# EAGLE schematic dlp.vco.v1.0 (EAGLE 7.2.0)
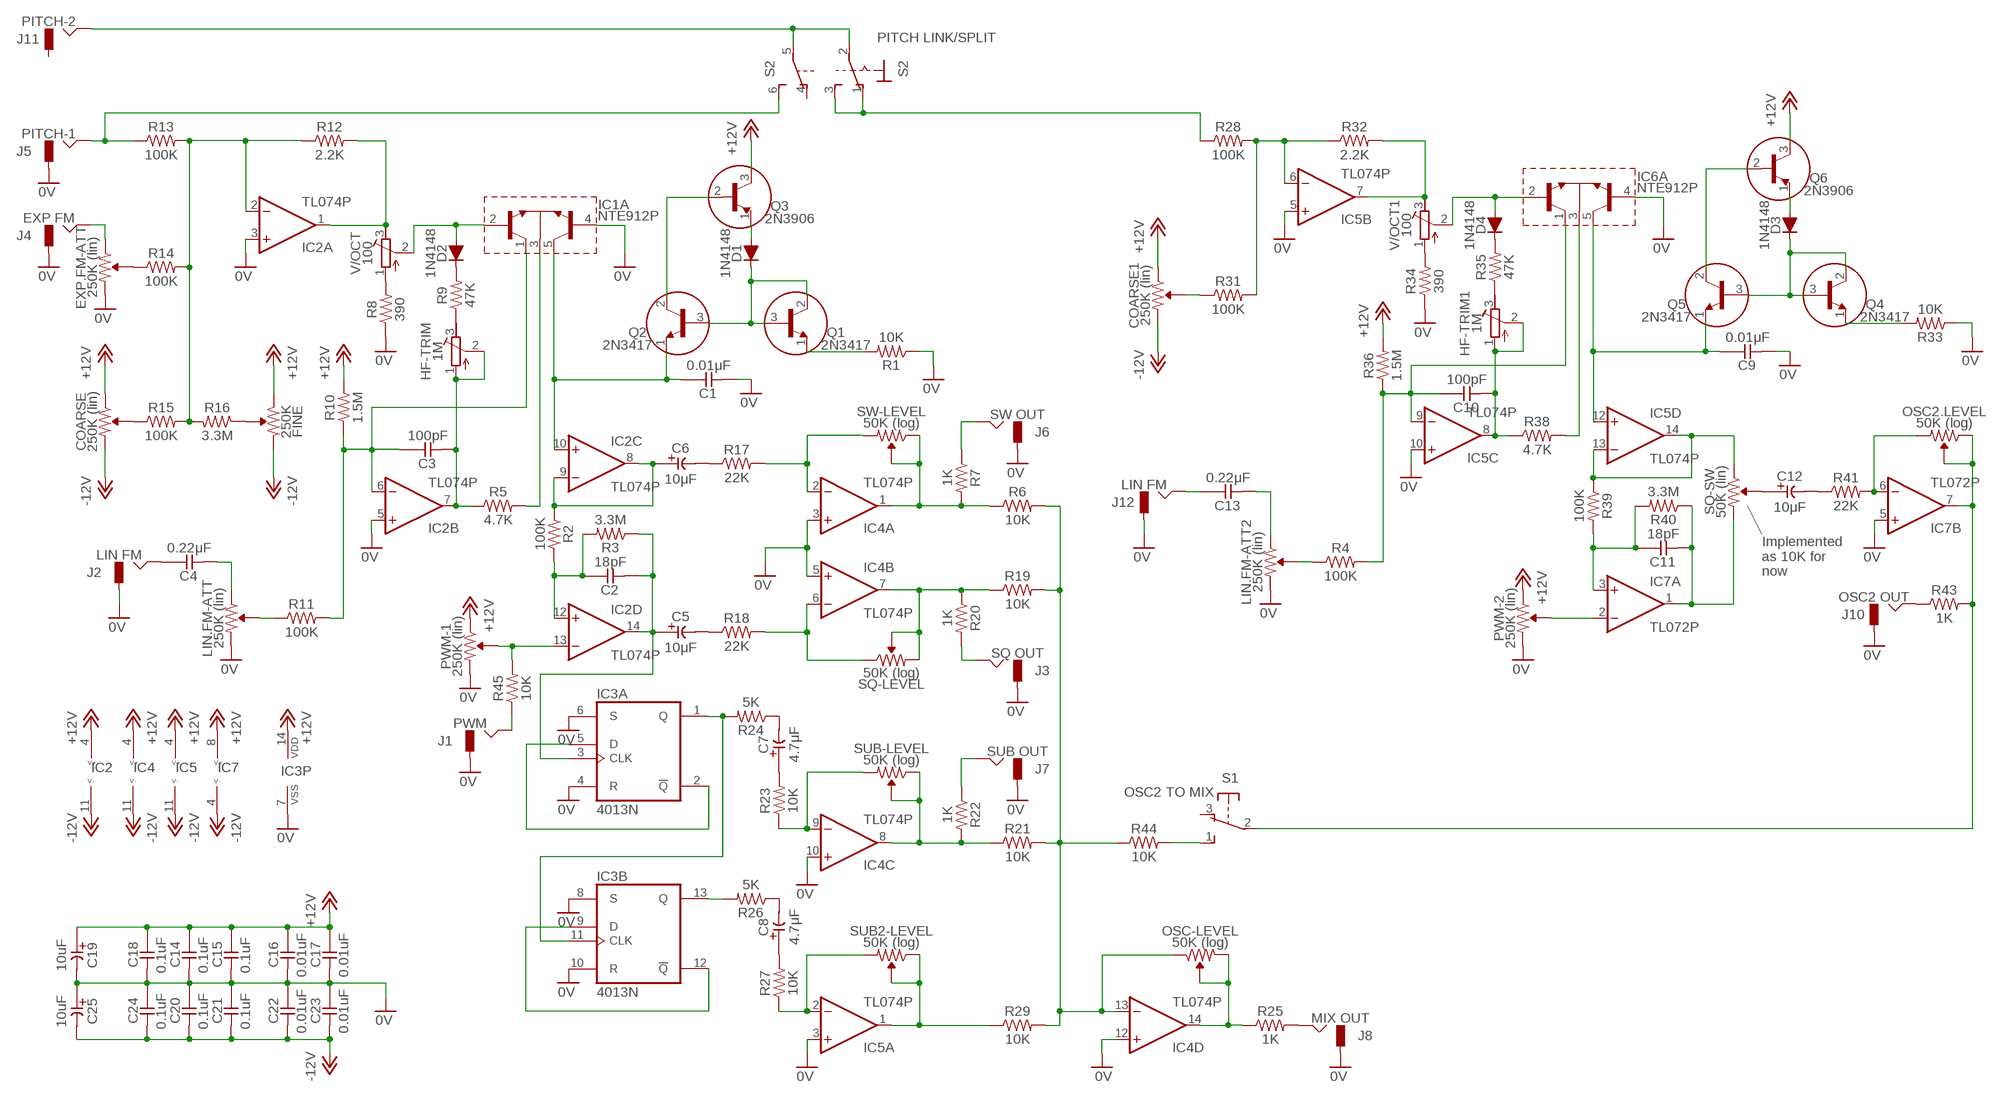
[diagram p0: schematic, sheet 1]

## Parts
C1  0.01μF  CC-US025-024X044  [C025-024X044]
C2  18pF  CC-US025-024X044  [C025-024X044]
C3  100pF  CC-US025-024X044  [C025-024X044]
C4  0.22μF  CC-US025-024X044  [C025-024X044]
C5  10μF  CE-USE2-5  [E2-5]
C6  10μF  CE-USE2-5  [E2-5]
C7  4.7μF  CE-USE2-5  [E2-5]
C8  4.7μF  CE-USE2-5  [E2-5]
C9  0.01μF  CC-US025-024X044  [C025-024X044]
C10  100pF  CC-US025-024X044  [C025-024X044]
C11  18pF  CC-US025-024X044  [C025-024X044]
C12  10μF  CE-USE2-5  [E2-5]
C13  0.22μF  CC-US025-024X044  [C025-024X044]
C14  0.1uF  CC-US025-024X044  [C025-024X044]
C15  0.1uF  CC-US025-024X044  [C025-024X044]
C16  0.01uF  CC-US025-024X044  [C025-024X044]
C17  0.01uF  CC-US025-024X044  [C025-024X044]
C18  0.1uF  CC-US025-024X044  [C025-024X044]
C19  10uF  CE-USE2-5  [E2-5]
C20  0.1uF  CC-US025-024X044  [C025-024X044]
C21  0.1uF  CC-US025-024X044  [C025-024X044]
C22  0.01uF  CC-US025-024X044  [C025-024X044]
C23  0.01uF  CC-US025-024X044  [C025-024X044]
C24  0.1uF  CC-US025-024X044  [C025-024X044]
C25  10uF  CE-USE2-5  [E2-5]
COARSE  250K (lin)  R-VAR  [R-VAR]
COARSE1  250K (lin)  R-VAR  [R-VAR]
D1  1N4148  [DO35-7]
D2  1N4148  [DO35-7]
D3  1N4148  [DO35-7]
D4  1N4148  [DO35-7]
EXP.FM-ATT  250K (lin)  R-VAR  [R-VAR]
FINE  250K  R-VAR  [R-VAR]
HF-TRIM  1M  R-TRIMM3304W  [RTRIM3304W]
HF-TRIM1  1M  R-TRIMM3304W  [RTRIM3304W]
IC1  NTE912P  [DIL14]
IC2  TL074P  [DIL14]
IC3  4013N  [DIL14]
IC4  TL074P  [DIL14]
IC5  TL074P  [DIL14]
IC6  NTE912P  [DIL14]
IC7  TL072P  [DIL08]
J1  PWM  JACK-M  [JACK-M]
J2  LIN FM  JACK-M  [JACK-M]
J3  SQ OUT  JACK-M  [JACK-M]
J4  EXP FM  JACK-M  [JACK-M]
J5  PITCH-1  JACK-M  [JACK-M]
J6  SW OUT  JACK-M  [JACK-M]
J7  SUB OUT  JACK-M  [JACK-M]
J8  MIX OUT  JACK-M  [JACK-M]
J10  OSC2 OUT  JACK-M  [JACK-M]
J11  PITCH-2  JACK-M  [JACK-M]
J12  LIN FM  JACK-M  [JACK-M]
LIN.FM-ATT  250K (lin)  R-VAR  [R-VAR]
LIN.FM-ATT2  250K (lin)  R-VAR  [R-VAR]
OSC2.LEVEL  50K (log)  R-VAR  [R-VAR]
OSC-LEVEL  50K (log)  R-VAR  [R-VAR]
PWM-1  250K (lin)  R-VAR  [R-VAR]
PWM-2  250K (lin)  R-VAR  [R-VAR]
Q1  2N3417  [TO92]
Q2  2N3417  [TO92]
Q3  2N3906  [TO92]
Q4  2N3417  [TO92]
Q5  2N3417  [TO92]
Q6  2N3906  [TO92]
R1  10K  R0309/10  [0309/10]
R2  100K  R0309/10  [0309/10]
R3  3.3M  R0309/10  [0309/10]
R4  100K  R0309/10  [0309/10]
R5  4.7K  R0309/10  [0309/10]
R6  10K  R0309/10  [0309/10]
R7  1K  R0309/10  [0309/10]
R8  390  R0309/10  [0309/10]
R9  47K  R0309/10  [0309/10]
R10  1.5M  R0309/10  [0309/10]
R11  100K  R0309/10  [0309/10]
R12  2.2K  R0309/10  [0309/10]
R13  100K  R0309/10  [0309/10]
R14  100K  R0309/10  [0309/10]
R15  100K  R0309/10  [0309/10]
R16  3.3M  R0309/10  [0309/10]
R17  22K  R0309/10  [0309/10]
R18  22K  R0309/10  [0309/10]
R19  10K  R0309/10  [0309/10]
R20  1K  R0309/10  [0309/10]
R21  10K  R0309/10  [0309/10]
R22  1K  R0309/10  [0309/10]
R23  10K  R0309/10  [0309/10]
R24  5K  R0309/10  [0309/10]
R25  1K  R0309/10  [0309/10]
R26  5K  R0309/10  [0309/10]
R27  10K  R0309/10  [0309/10]
R28  100K  R0309/10  [0309/10]
R29  10K  R0309/10  [0309/10]
R31  100K  R0309/10  [0309/10]
R32  2.2K  R0309/10  [0309/10]
R33  10K  R0309/10  [0309/10]
R34  390  R0309/10  [0309/10]
R35  47K  R0309/10  [0309/10]
R36  1.5M  R0309/10  [0309/10]
R38  4.7K  R0309/10  [0309/10]
R39  100K  R0309/10  [0309/10]
R40  3.3M  R0309/10  [0309/10]
R41  22K  R0309/10  [0309/10]
R43  1K  R0309/10  [0309/10]
R44  10K  R0309/10  [0309/10]
R45  10K  R0309/10  [0309/10]
S1  OSC2 TO MIX  9077-1  [9077-1]
S2  320-938  [320-938]
SQ-LEVEL  50K (log)  R-VAR  [R-VAR]
SQ-SW  50K (lin)  R-VAR  [R-VAR]
SUB2-LEVEL  50K (log)  R-VAR  [R-VAR]
SUB-LEVEL  50K (log)  R-VAR  [R-VAR]
SW-LEVEL  50K (log)  R-VAR  [R-VAR]
V/OCT  100  R-TRIMM3304W  [RTRIM3304W]
V/OCT1  100  R-TRIMM3304W  [RTRIM3304W]

## Nets
0V: C1.2 C9.2 C14.2 C15.2 C16.2 C17.2 C18.2 C19.- C20.1 C21.1 C22.1 C23.1 C24.1 C25.+ EXP.FM-ATT.R2 IC1.4(A:B3) IC2.3(A:+IN) IC2.5(B:+IN) IC3.4(A:R) IC3.6(A:S) IC3.7(P:VSS) IC3.8(B:S) IC3.10(B:R) IC4.3(A:+IN) IC4.5(B:+IN) IC4.10(C:+IN) IC4.12(D:+IN) IC5.3(A:+IN) IC5.5(B:+IN) IC5.10(C:+IN) IC6.4(A:B3) IC7.5(B:+IN) J1.GND J2.GND J3.GND J4.GND J5.GND J6.GND J7.GND J8.GND J10.GND J12.GND LIN.FM-ATT2.R2 LIN.FM-ATT.R2 PWM-1.R2 PWM-2.R2 R1.1 R8.1 R33.1 R34.1
+12V: C14.1 C15.1 C16.1 C17.1 C18.1 C19.+ COARSE1.R1 COARSE.R1 FINE.R1 IC2.4(P:V+) IC3.14(P:VDD) IC4.4(P:V+) IC5.4(P:V+) IC7.8(P:V+) PWM-1.R1 PWM-2.R1 Q3.3(C) Q6.3(C) R10.2 R36.2
-12V: C20.2 C21.2 C22.2 C23.2 C24.2 C25.- COARSE1.R2 COARSE.R2 FINE.R2 IC2.11(P:V-) IC4.11(P:V-) IC5.11(P:V-) IC7.4(P:V-)
N$1: C1.1 IC1.5(A:C3) IC2.10(C:+IN) Q2.1(E)
N$2: Q2.2(C) Q3.2(B)
N$3: D1.A Q3.1(E)
N$4: C6.+ IC2.8(C:OUT) IC2.9(C:-IN) R2.1
N$5: D1.C Q1.2(C) Q1.3(B) Q2.3(B)
N$6: Q1.1(E) R1.2
N$7: C2.1 IC2.12(D:+IN) R2.2 R3.2
N$8: J1.HOT R45.1
N$9: C2.2 C5.+ IC2.14(D:OUT) IC3.3(A:CLK) R3.1
N$10: IC2.13(D:-IN) PWM-1.VAR R45.2
N$11: C3.2 HF-TRIM.1(E) HF-TRIM.2(S) IC2.7(B:OUT) R5.1
N$12: IC1.3(A:E) R5.2
N$13: D2.C R9.2
N$14: R8.2 V/OCT.1(E)
N$15: C3.1 IC1.1(A:C1) IC2.6(B:-IN) R10.1 R11.2
N$16: IC2.1(A:OUT) R12.2 V/OCT.3(A)
N$17: HF-TRIM.3(A) R9.1
N$18: LIN.FM-ATT.VAR R11.1
N$19: C4.2 LIN.FM-ATT.R1
N$20: C4.1 J2.HOT
N$21: IC3.1(A:Q) IC3.11(B:CLK) R24.2
N$22: IC4.2(A:-IN) R17.2 SW-LEVEL.R2
N$23: EXP.FM-ATT.VAR R14.1
N$24: COARSE.VAR R15.1
N$25: FINE.VAR R16.1
N$26: EXP.FM-ATT.R1 J4.HOT
N$27: J11.HOT S2.2(1:P) S2.5(B:P)
N$28: IC2.2(A:-IN) R12.1 R13.2 R14.2 R15.2 R16.2
N$29: C6.- R17.1
N$30: C5.- R18.1
N$31: IC4.1(A:OUT) R6.1 R7.2 SW-LEVEL.R1 SW-LEVEL.VAR
N$32: IC4.7(B:OUT) R19.1 R20.1 SQ-LEVEL.R2 SQ-LEVEL.VAR
N$33: C7.+ R23.2
N$34: IC4.6(B:-IN) R18.2 SQ-LEVEL.R1
N$35: IC3.2(A:!Q) IC3.5(A:D)
N$36: C7.- R24.1
N$37: J3.HOT R20.2
N$38: J6.HOT R7.1
N$39: J7.HOT R22.1
N$40: IC4.9(C:-IN) R23.1 SUB-LEVEL.R2
N$41: IC4.8(C:OUT) R21.1 R22.2 SUB-LEVEL.R1 SUB-LEVEL.VAR
N$42: C8.- R26.1
N$43: IC3.13(B:Q) R26.2
N$44: J8.HOT R25.2
N$45: C12.- R41.1
N$46: IC7.2(A:-IN) PWM-2.VAR
N$47: IC3.9(B:D) IC3.12(B:!Q)
N$48: C8.+ R27.2
N$49: IC5.2(A:-IN) R27.1 SUB2-LEVEL.R2
N$50: IC5.1(A:OUT) R29.1 SUB2-LEVEL.R1 SUB2-LEVEL.VAR
N$51: C13.1 J12.HOT
N$52: COARSE1.VAR R31.1
N$53: D2.A IC1.2(A:B1) V/OCT.2(S)
N$54: IC5.6(B:-IN) R28.2 R31.2 R32.1
N$55: IC4.14(D:OUT) OSC-LEVEL.R2 OSC-LEVEL.VAR R25.1
N$56: C9.1 IC5.12(D:+IN) Q5.1(E)
N$57: D3.A Q6.1(E)
N$58: Q4.1(E) R33.2
N$59: D3.C Q4.2(C) Q4.3(B) Q5.3(B)
N$60: Q5.2(C) Q6.2(B)
N$61: C10.2 HF-TRIM1.1(E) HF-TRIM1.2(S) IC5.8(C:OUT) R38.1
N$62: IC6.3(A:E) R38.2
N$63: D4.C R35.2
N$64: C10.1 IC5.9(C:-IN) R4.2 R36.1
N$65: IC5.7(B:OUT) R32.2 V/OCT1.3(A)
N$66: R34.2 V/OCT1.1(E)
N$67: HF-TRIM1.3(A) R35.1
N$68: IC5.13(D:-IN) IC5.14(D:OUT) R39.1 SQ-SW.R1
N$69: C11.1 IC7.3(A:+IN) R39.2 R40.2
N$70: C11.2 IC7.1(A:OUT) R40.1 SQ-SW.R2
N$71: D4.A IC6.2(A:B1) V/OCT1.2(S)
N$72: C12.+ SQ-SW.VAR
N$73: IC7.6(B:-IN) OSC2.LEVEL.R2 R41.2
N$74: IC7.7(B:OUT) OSC2.LEVEL.R1 OSC2.LEVEL.VAR R43.2 S1.2(P)
N$75: J10.HOT R43.1
N$76: R44.2 S1.1(S)
N$77: IC4.13(D:-IN) OSC-LEVEL.R1 R6.2 R19.2 R21.2 R29.2 R44.1
N$78: J5.HOT R13.1 S2.6(B:S)
N$79: R28.1 S2.1(1:O) S2.3(1:S)
N$80: LIN.FM-ATT2.VAR R4.1
N$81: C13.2 LIN.FM-ATT2.R1
Unconnected: IC1.6(B:B) IC1.7(B:E) IC1.8(B:C) IC1.9(C:B) IC1.10(C:E) IC1.11(C:C) IC1.12(D:B) IC1.13(D:E) IC1.14(D:C) IC6.1(A:C1) IC6.5(A:C3) IC6.6(B:B) IC6.7(B:E) IC6.8(B:C) IC6.9(C:B) IC6.10(C:E) IC6.11(C:C) IC6.12(D:B) IC6.13(D:E) IC6.14(D:C) J11.GND S1.3(O) S2.4(B:O)

## Notes on the sheet
- PITCH LINK/SPLIT
- Implemented
  as 10K for 
  now
- IC2 | IC4 | IC5 | IC7

## Library data of the parts
C1-C4 C9-C11 C13-C18 C20-C24 = _common:CC-US: CAPACITOR, US symbol
C5-C8 C12 C19 C25 = _common:CE-US: ELECTROLYTIC CAPACITOR, US symbol
COARSE COARSE1 EXP.FM-ATT FINE LIN.FM-ATT LIN.FM-ATT2 OSC2.LEVEL OSC-LEVEL PWM-1 PWM-2 SQ-LEVEL SQ-SW SUB2-LEVEL SUB-LEVEL SW-LEVEL = _common:R-VAR
D1-D4 = _common:1N4148: DIODE high speed (Philips)
HF-TRIM HF-TRIM1 V/OCT V/OCT1 = _common:R-TRIMM: Trimm resistor
IC1 IC6 = _common:NTE912: NPN TRANSISTOR ARRAY
IC2 IC4 IC5 = _common:TL074: OP AMP
IC3 = 40xx:4013: Dual D FLIP FLOP, set/reset
IC7 = _common:TL072: OP AMP
J1-J8 J10-J12 = _common:JACK-M
Q1 Q2 Q4 Q5 = _common:2N3417: NPN Transistor
Q3 Q6 = _common:2N3906: PNP Transistor
R1-R29 R31-R36 R38-R41 R43-R45 = _common:R: RESISTOR, US symbol
S1 = switch-misc:9077-1: MARQUARDT SWITCH 9077.0100 Distributor: Buerklin <https://www.buerklin.com/default.asp?event=ShowArtikel%2812G2820%29&l=d&jump=ArtNr_12G2820>
S2 = switch:320-938: TOGGLE SWITCH distributor RS Components